# Altium project motion_board.PrjPcb
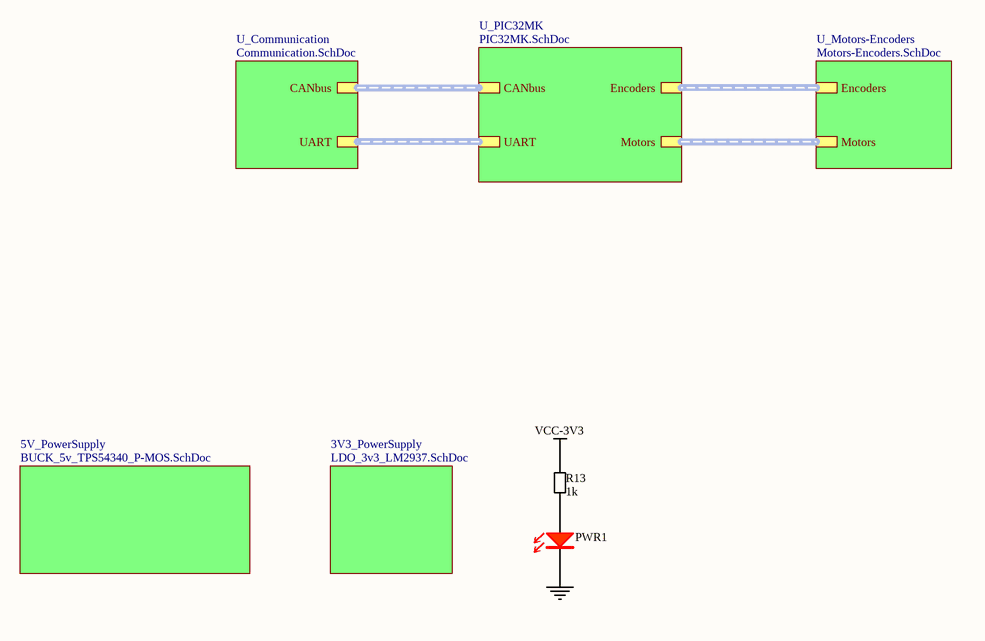
[diagram p0: Motion_Driver_v2.SchDoc]
11 sheets, 132 parts. Net scope: hierarchical (ports join the sheet entries above them; power ports are global).
Board file: Motion_Driver_v2.PcbDoc
Sheets:
  Motion_Driver_v2.SchDoc
    5V_PowerSupply = BUCK_5v_TPS54340_P-MOS.SchDoc
    3V3_PowerSupply = LDO_3v3_LM2937.SchDoc
    U_Communication = Communication.SchDoc
      CANbus = CANbus.SchDoc
    U_PIC32MK = PIC32MK.SchDoc
      Reset = MCLR_PIC.SchDoc
      Oscillator = 8MHz_Crystal.SchDoc
    U_Motors-Encoders = Motors-Encoders.SchDoc
      Encoder_Odometry_1 = Encoder.SchDoc
      Encoder_Odometry_2 = Encoder.SchDoc
      Encoder_Motor_1 = Encoder.SchDoc
      Encoder_Motor_2 = Encoder.SchDoc
      H-Bridge1 = H_Bridge.SchDoc
      H_Bridge_2 = H_Bridge.SchDoc

## Sheet Motion_Driver_v2.SchDoc: Motion Driver
size A4; Author: Nikola Rašević; Organization: Memristor-Robotics; Address1: Vladimira Perića Valtera 2; Address2: 21000 Novi Sad; Address3: Serbia; Revision: v2; SheetNumber: 1; SheetTotal: 11

### Parts
PWR1  LED RED  [LED_RED_0805]  (value not drawn)
R13  1k  [RESC2013X38N-0805-NOOVERLAY]

### Sub-sheets
3V3_PowerSupply = LDO_3v3_LM2937.SchDoc: no entries
5V_PowerSupply = BUCK_5v_TPS54340_P-MOS.SchDoc: no entries
U_Communication = Communication.SchDoc: CANbus (harness CANbus), UART (harness UART)
U_Motors-Encoders = Motors-Encoders.SchDoc: Encoders (harness Encoders), Motors (harness Motors)
U_PIC32MK = PIC32MK.SchDoc: CANbus (harness CANbus), UART (harness UART), Encoders (harness Encoders), Motors (harness Motors)

### Nets
GND: PWR1.1(C)
VCC-3V3: R13.2
NetPWR1_2: PWR1.2(A) R13.1

### Buses and harness runs
harness sheet U_Communication/CANbus = sheet U_PIC32MK/CANbus
harness sheet U_Communication/UART = sheet U_PIC32MK/UART
harness sheet U_Motors-Encoders/Encoders = sheet U_PIC32MK/Encoders
harness sheet U_Motors-Encoders/Motors = sheet U_PIC32MK/Motors

### Notes on the sheet
- Title
- Date:
- Design Engineer:
- Time:
- Revision:
- Sheet
- of
- Size:
- A4
- www.memristor-robotics.io
- File:

### Library data of the parts
PWR1 = LED_RED_0805: LED RED 0805; Manufacturer: BRIGHT LED ELECTRONICS; Manufacturer Part Number: BL-HUB35A-AV-TRB; Barcode: 2911010024321; id: 35; Assembly: SMD; Voltage Forward: 2.0 V; item_id: 3341; Recommended Rating: Platinum; Package Case: 0805 (2012 Metric); Color: Red; Family: LED; Part Type: Optoelectronics
R13 = 00001001: RES SMD 1 kOhm 1/8W 0805; Power: 0.125W, 1/8W; Barcode: 00009101; Resistance: 1k; Assembly: SMD

## Sheet BUCK_5v_TPS54340_P-MOS.SchDoc: Memristor Power 5.0
size A4; Author: Nikola Rašević; Organization: Memristor-Robotics; Address1: Vladimira Perića Valtera 2; Address2: 21000 Novi Sad; Address3: Serbia; Revision: v1; SheetNumber: 2; SheetTotal: 11
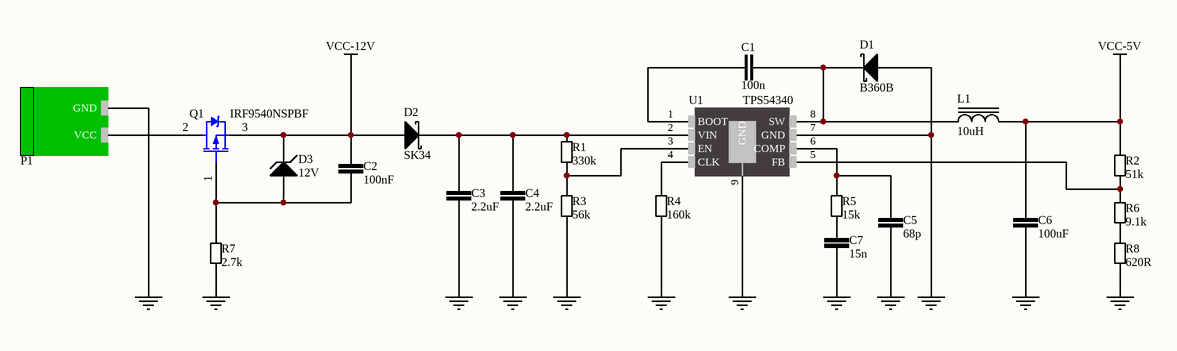
[diagram p1: BUCK_5v_TPS54340_P-MOS.SchDoc]

### Parts
C1  100n  [CER_0603]
C2  100nF  [CER_0805]
C3  2.2uF  [CER_1210]
C4  2.2uF  [CER_1210]
C5  68p  [CER_0603]
C6  100uF  [CER_1210]
C7  15n  [CER_0603]
D1  B360B  [DO214AC]
D2  SK34  [DO214AC]
D3  12V  [DO214AC]
L1  10uH  [INDUCTOR_SS1260-103MLD]
P1  2EDGRC-5.08-02P-14-00A(H)  [PWR_Con]  (value not drawn)
Q1  IRF9540NSPBF  [D2PAK-2]
R1  330k  [RESC2013X38N-0805-NOOVERLAY]
R2  51k  [RESC2013X38N-0805-NOOVERLAY]
R3  56k  [RESC2013X38N-0805-NOOVERLAY]
R4  160k  [RESC2013X38N-0805-NOOVERLAY]
R5  15k  [RESC2013X38N-0805-NOOVERLAY]
R6  9.1k  [RESC2013X38N-0805-NOOVERLAY]
R7  2.7k  [RESC2013X38N-0805-NOOVERLAY]
R8  620R  [RESC2013X38N-0805-NOOVERLAY]
U1  TPS54340  [HSOP-8]

### Nets
GND: C3.1 C4.1 C5.1 C6.1 C7.1 D1.2(Anode) P1.1(GND) R3.1 R4.1 R7.1 R8.1 U1.7(GND) U1.9(GND)
VCC-5V: C6.2 L1.2 R2.2
VCC-12V: C2.2 D2.2(Anode) D3.1(Cathode) Q1.3(S)
NetC1_1: C1.1 U1.1(BOOT)
NetC1_2: C1.2 D1.1(Cathode) L1.1 U1.8(SW)
NetC2_1: C2.1 D3.2(Anode) Q1.1(G) R7.2
NetC3_2: C3.2 C4.2 D2.1(Cathode) R1.2 U1.2(VIN)
NetC5_2: C5.2 R5.2 U1.6(COMP)
NetC7_2: C7.2 R5.1
NetP1_2: P1.2(VCC) Q1.2(D)
NetR1_1: R1.1 R3.2 U1.3(EN)
NetR2_1: R2.1 R6.2 U1.5(FB)
NetR4_2: R4.2 U1.4(CLK)
NetR6_1: R6.1 R8.2

### Notes on the sheet
- Title
- Date:
- Design Engineer:
- Time:
- Revision:
- Sheet
- of
- Size:
- A4
- www.memristor-robotics.io
- File:

### Library data of the parts
C1 = 06032105: CAP CER 100n 10V X5R 10% 0603; Capacitance: 100n
C2 = 00002105: CAP CER 100n 50V X7R 10% 0805; Capacitance: 100nF
C3 C4 = 00001225: CAP CER 2.2u; Value: 2.2uF
C5 = 06032680: CAP CER 68p 0603; Capacitance: 68p
C6 = 00002108: CAP CER 100u X5R 6.3V 10% 1210; Capacitance: 100uF
C7 = 06032153: CAP CER 15n 0603; Capacitance: 15n
D1 = B360B: DIODE SCHOTTKY 60V 3A DO214AC; Manufacturer: Vishay Semiconductor Diodes Division; Barcode: 0100000007488; id: 62; Assembly: SMD; Speed: Fast Recovery =< 500ns, > 200mA (Io); Voltage  Forward: 550mV @ 3A; item_id: 1025; Recommended Rating: Silver; Manufacturer Part Number: B360B; Category: Discrete Semiconductor Products; Datasheet URL: http://www.vishay.com/docs/88896/b330la.pdf; Package Case: DO-214AC, SMA; Family: DIODE; Voltage  DC Reverse: 60V; Current  Average Rectified: 3A; Diode Type: Schottky; Part Type: Discrete Semiconductors
D2 = SK34: DIODE SCHOTTKY 40V 3A DO214AC; Manufacturer: Vishay Semiconductor Diodes Division; Barcode: 0100000007488; id: 62; Assembly: SMD; Speed: Fast Recovery =< 500ns, > 200mA (Io); Voltage  Forward: 550mV @ 3A; item_id: 1025; Recommended Rating: Silver; Manufacturer Part Number: SK34; Category: Discrete Semiconductor Products; Datasheet URL: http://www.vishay.com/docs/88896/b330la.pdf; Package Case: DO-214AC, SMA; Family: DIODE; Voltage  DC Reverse: 40V; Current  Average Rectified: 3A; Diode Type: Schottky; Part Type: Discrete Semiconductors
D3 = ZENER: DIODE ZENER; Manufacturer: Vishay Semiconductor Diodes Division; Manufacturer Part Number: B360B; Barcode: 0100000007488; id: 62; Assembly: SMD; Speed: Fast Recovery =< 500ns, > 200mA (Io); Voltage  DC Reverse: 60V; Current  Average Rectified: 3A; Voltage  Forward: 550mV @ 3A; Diode Type: Schottky; item_id: 1025; Recommended Rating: Silver; Category: Discrete Semiconductor Products; Datasheet URL: http://www.vishay.com/docs/88896/b330la.pdf; Package Case: DO-214AC, SMA; Family: DIODE; Part Type: Discrete Semiconductors; Refferent Voltage: 12V
L1 = Inductor_10uH: FIXED IND 10uH 5.3A; Manufacturer: Coilcraft; Manufacturer Part Number: XAL7030-103MEB; Barcode: 2911010049126; id: 7; Assembly: SMD; Tolerance: 20%; Value: 10u; DC Resistance: 62.7mOhm; item_id: 5593; Category: Inductors, Coils, Chokes; Datasheet URL: http://www.mouser.com/ds/2/597/xal7030-270749.pdf; Package Case: 8x8mm; Inductance: 10uH; Current Rating: 5.3A; Family: INDUCTOR; Part Type: Inductor, Transf, Filter, Ferrite
P1 = 00000002: TERM BLOCK HDR 2POS 90DEG 5.08MM; Suplier: TME; Manufacturer Part Number: 2EDGRC-5.08-02P-14-00A(H); Suplier Product Link: https://www.tme.eu/en/details/2edgrc5.08-2p14/pluggable-terminal-blocks/degson-electronics/2edgrc-508-02p-14-00ah/; Price: 0.1304
Q1 = IRF9540N: P-MOS; Manufacturer: INTERNATIONAL RECTIFIER; Manufacturer Part Number: IRF9540NSPBF; Order Code: IRF9540NS; Package: TO-263 SMD; Price: DIN 62.54; Supplier: Comet.rs
R1 = 00003303: RES SMD 330 kOhm 1/8W 0805; Power: 0.125W, 1/8W; Resistance: 330k; Assembly: SMD; Barcode: 00003303
R2 = 00005102: RES SMD 51 kOhm 1/8W 0805; Power: 0.125W, 1/8W; Resistance: 51k; Assembly: SMD; Barcode: 00005102
R3 = 00005602: RES SMD 56 kOhm 1/8W 0805; Power: 0.125W, 1/8W; Barcode: 00004701; Resistance: 56k; Assembly: SMD
R4 = 00001603: RES SMD 160 kOhm 1/8W 0805; Power: 0.125W, 1/8W; Resistance: 160k; Assembly: SMD; Barcode: 00001603
R5 = 00001502: RES SMD 15 kOhm 1/8W 0805; Power: 0.125W, 1/8W; Resistance: 15k; Assembly: SMD; Barcode: 00001502
R6 = 00009101: RES SMD 9.1 kOhm 1/8W 0805; Power: 0.125W, 1/8W; Resistance: 9.1k; Assembly: SMD; Barcode: 00009101
R7 = 00002701: RES SMD 2.7 kOhm 1/8W 0805; Power: 0.125W, 1/8W; Barcode: 00004701; Resistance: 2.7k; Assembly: SMD
R8 = 00006200: RES SMD 620 Ohm 1/8W 0805; Power: 0.125W, 1/8W; Resistance: 620R; Assembly: SMD; Barcode: 00006200
U1 = TPS54340: IC REG BUCK ADJ 3.5A 8SOPWRPAD; Assembly: SMD; Manufacturer Part Number: TPS54340

## Sheet LDO_3v3_LM2937.SchDoc: 3v3 LDO Module
size A4; Author: Nikola Rašević; Organization: Memristor Robotics; SheetNumber: 3; SheetTotal: 11
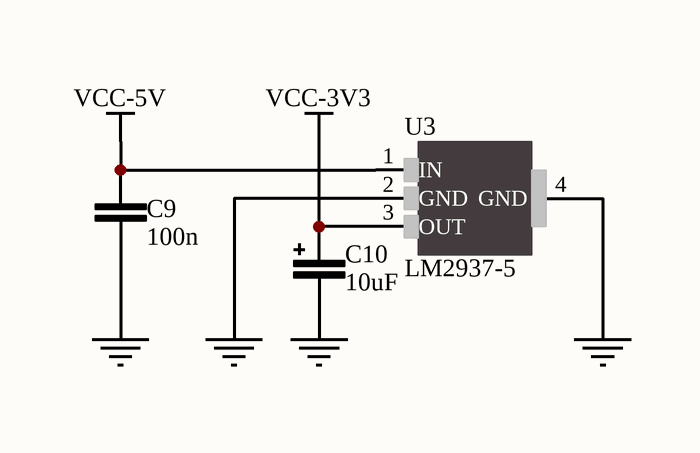
[diagram p2: LDO_3v3_LM2937.SchDoc]

### Parts
C9  100n  [CER_0603]
C10  10uF  [TANT_1210]
U3  LM2937-5  [SOT223]

### Nets
GND: C9.1 C10.2 U3.2(GND) U3.4(GND)
VCC-3V3: C10.1 U3.3(OUT)
VCC-5V: C9.2 U3.1(IN)

### Notes on the sheet
- Title
- Date:
- Design Engineer:
- Time:
- Revision:
- Sheet
- of
- Size:
- A4
- www.memristor-robotics.io
- File:

### Library data of the parts
C9 = 06032105: CAP CER 100n 10V X5R 10% 0603; Capacitance: 100n
C10 = 00001106: CAP TANT 10u; Value: 10uF
U3 = 00000007: IC REG LINEAR 5V 400MA SOT223-4; Manufacturer Part Number: LM2937-5; Datasheet Link: http://www.ti.com/lit/ds/symlink/lm2937.pdf

## Sheet Communication.SchDoc
size A4; Organization: Memristor-Robotics; Address1: Vladimira Perića Valtera; Address2: Novi Sad, 21000; Address3: Serbia; SheetNumber: 7; SheetTotal: 11
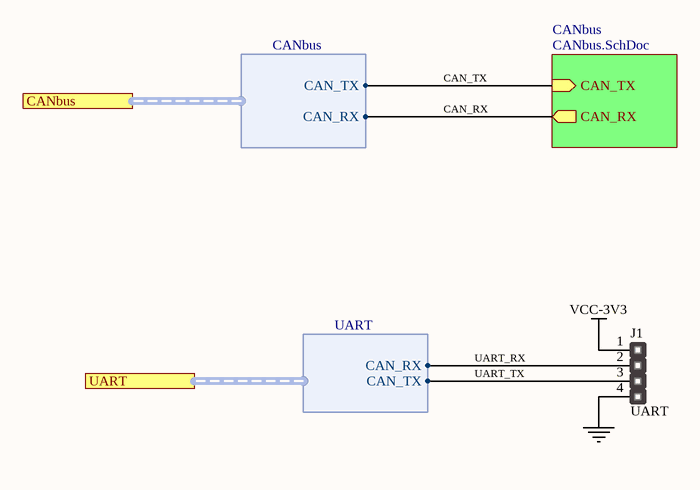
[diagram p3: Communication.SchDoc]

### Parts
J1  UART  [HM1X4]

### Sub-sheets
CANbus = CANbus.SchDoc: CAN_TX (in), CAN_RX (out)

### Ports
CANbus (harness CANbus), UART (harness UART)

### Harnesses
CANbus: CAN_TX, CAN_RX
UART: CAN_TX, CAN_RX

### Nets
GND: J1.4
VCC-3V3: J1.1
CAN_RX: sheet CANbus/CAN_RX, port CANbus.CAN_RX
CAN_TX: sheet CANbus/CAN_TX, port CANbus.CAN_TX
UART_RX: J1.2 ; port UART.CAN_RX
UART_TX: J1.3 ; port UART.CAN_TX

### Notes on the sheet
- Title
- Date:
- Design Engineer:
- Time:
- Revision:
- Sheet
- of
- Size:
- A4
- www.memristor-robotics.io
- File:

### Library data of the parts
J1 = HEADER_1x4

## Sheet CANbus.SchDoc: CANbus Module
size A4; Author: Nikola Rašević; Organization: Memristor Robotics; SheetNumber: 8; SheetTotal: 11
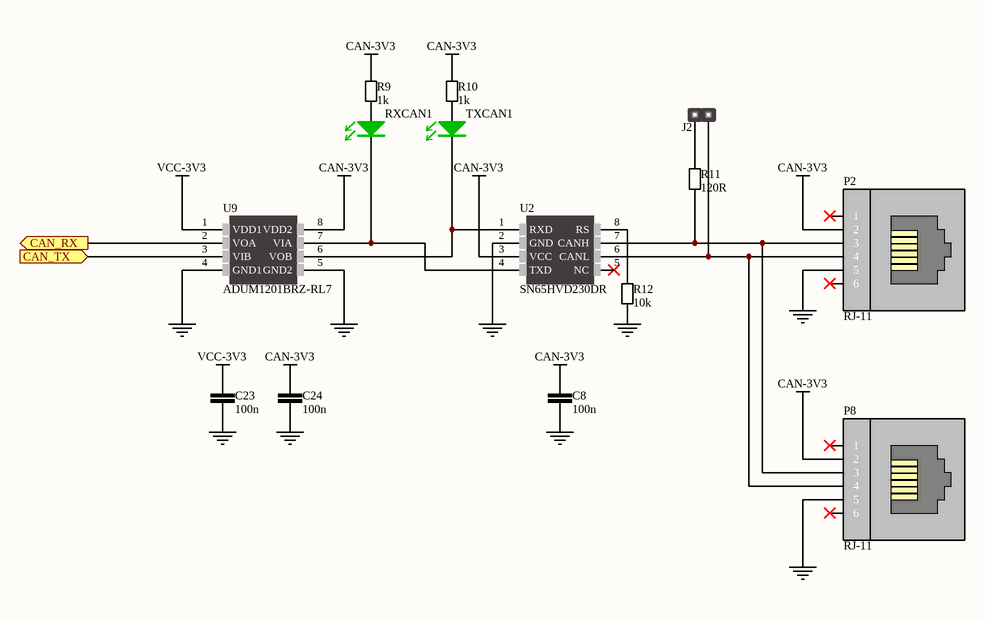
[diagram p4: CANbus.SchDoc]

### Parts
C8  100n  [CER_0805]
C23  100n  [CER_0805]
C24  100n  [CER_0805]
J2  *  [HM1x2]  (value not drawn)
P2  RJ-11  [RJ11-6N-B]
P8  RJ-11  [RJ11-6N-B]
R9  1k  [RESC2013X38N-0805-NOOVERLAY]
R10  1k  [RESC2013X38N-0805-NOOVERLAY]
R11  120R  [RESC2013X38N-0805-NOOVERLAY]
R12  10k  [RESC2013X38N-0805-NOOVERLAY]
RXCAN1  LED GREEN  [LED_GREEN_0805]  (value not drawn)
TXCAN1  LED GREEN  [LED_GREEN_0805]  (value not drawn)
U2  SN65HVD230DR  [SOIC-8]
U9  ADUM1201BRZ-RL7  [SOIC-8]

### Ports
CAN_RX (out), CAN_TX (in)

### Nets
CAN-3V3: C8.2 C24.2 P2.2 P8.2 R9.2 R10.2 U2.3(VCC) U9.8(VDD2)
GND: C8.1 C23.1 C24.1 P2.5 P8.5 R12.1 U2.2(GND) U9.4(GND1) U9.5(GND2)
VCC-3V3: C23.2 U9.1(VDD1)
CAN_RX: U9.2(VOA) ; port CAN_RX
CAN_TX: U9.3(VIB) ; port CAN_TX
NetJ2_1: J2.1 R11.2
NetJ2_2: J2.2 P2.4 P8.4 U2.6(CANL)
NetP2_3: P2.3 P8.3 R11.1 U2.7(CANH)
NetR9_1: R9.1 RXCAN1.2(A)
NetR10_1: R10.1 TXCAN1.2(A)
NetR12_2: R12.2 U2.8(RS)
NetRXCAN1_1: RXCAN1.1(C) U2.4(TXD) U9.7(VIA)
NetTXCAN1_1: TXCAN1.1(C) U2.1(RXD) U9.6(VOB)

Not connected (* = marked no-connect by the designer): P2 1* 6*; P8 1* 6*; U2 5(NC)*

### Notes on the sheet
- Title
- Date:
- Design Engineer:
- Time:
- Revision:
- Sheet
- of
- Size:
- A4
- www.memristor-robotics.io
- File:

### Library data of the parts
C8 C23 C24 = 06032105: CAP CER 100n 10V X5R 10% 0603; Capacitance: 100n
J2 = HEADER_1x2: Manufacturer Part Number: *
P2 = 00000001: Manufacturer Part Number: RJ-11
P8 = 00000001: CONN MOD JACK 6P4C R/A UNSHLD; Manufacturer Part Number: 0955012641; Type: RJ-11
R9 R10 = 00001001: as R13 on sheet Motion_Driver_v2; Resistance: 1k; Assembly: SMD
R11 = 000001200: RES SMD 120 Ohm 1/8W 0805; Resistance: 120R
R12 = 000001002: RES SMD 10 kOhm 1/8W 0805; Resistance: 10k
RXCAN1 TXCAN1 = LED_GREEN 0805: LED GREEN CLEAR 0805 SMD; Manufacturer: Kingbright; Manufacturer Part Number: APT2012SGC; Barcode: 2911010024338; id: 28; Voltage Forward: 2.2V; Wavelength: 568nm; Lens Color: Colorless; item_id: 3342; Recommended Rating: Platinum; Category: Optoelectronics; Assembly: SMD; Datasheet URL: http://www.kingbrightusa.com/images/catalog/SPEC/APT2012SGC.pdf; Package Case: 0805 (2012 Metric); Color: Green; Family: LED; Lens Transparency: Clear; Part Type: Optoelectronics
U2 = SN65HVD230: IC EMC CAN TRANSCEIVER 8-SOIC; Assembly: SMD; Barcode: 00000001; Manufacturer Part Number: SN65HVD230DR; Comet Product Page: http://store.comet.rs/Catalogue/Product/9057/; Datasheet Link: http://www.ti.com/lit/ds/symlink/sn65hvd232.pdf; Category: Integrated Circuits (ICs); Package: SOIC-8; Family: Comunication
U9 = ADUM1201BRZ: DGTL ISO 2.5KV GEN PURP 8SOIC; Assembly: SMD; Barcode: 00000001; Manufacturer Part Number: ADUM1201BRZ-RL7; Datasheet Link: http://www.analog.com/media/en/technical-documentation/data-sheets/ADuM1200_1201.pdf; Category: Integrated Circuits (ICs); Package: SOIC-8; Family: Comunication

## Sheet PIC32MK.SchDoc
size A4; Organization: Memristor-Robotics; Address1: Vladimira Perića Valtera; Address2: Novi Sad, 21000; Address3: Serbia; SheetNumber: 4; SheetTotal: 11
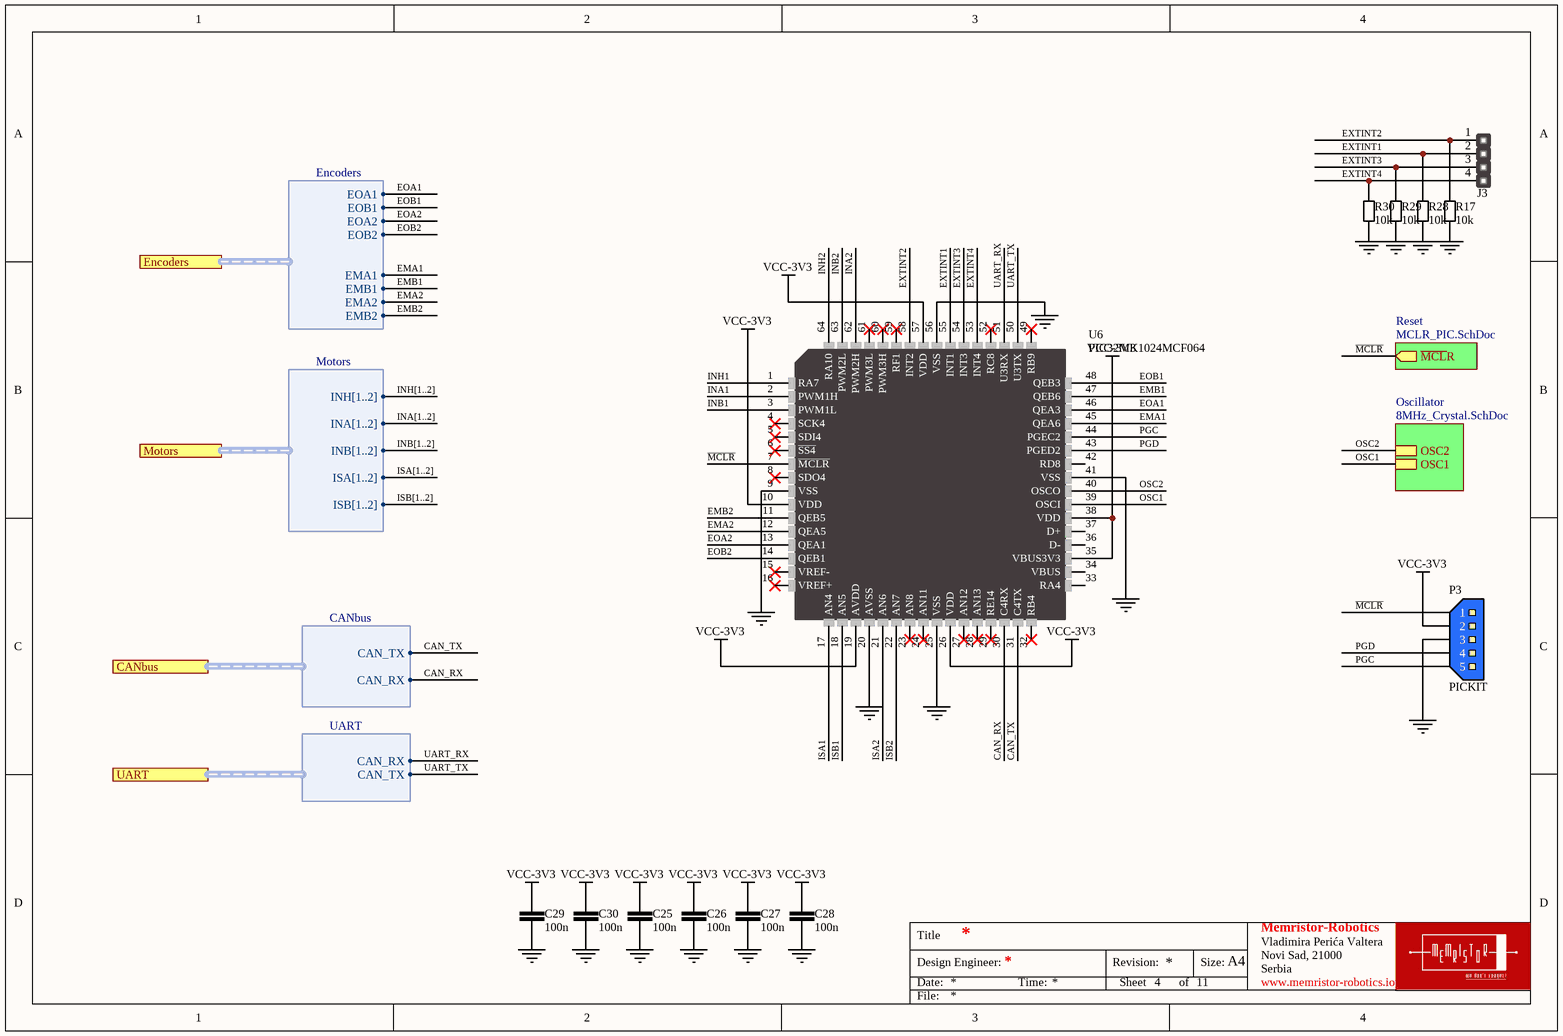
[diagram p5: PIC32MK.SchDoc]

### Parts
C25  100n  [CER_0603]
C26  100n  [CER_0603]
C27  100n  [CER_0603]
C28  100n  [CER_0603]
C29  100n  [CER_0603]
C30  100n  [CER_0603]
J3  EXTINT  [HM1X4]  (value not drawn)
P3  PICKIT  [TE CONNECTIVITY_5PIN_MALE]
R17  10k  [RESC2013X38N-0805-NOOVERLAY]
R28  10k  [RESC2013X38N-0805-NOOVERLAY]
R29  10k  [RESC2013X38N-0805-NOOVERLAY]
R30  10k  [RESC2013X38N-0805-NOOVERLAY]
U6  PIC32MK1024MCF064  [TQFP-64-500um]

### Sub-sheets
Oscillator = 8MHz_Crystal.SchDoc: OSC2, OSC1
Reset = MCLR_PIC.SchDoc: ~{MCL}R (out)

### Ports
CANbus (harness CANbus), Encoders (harness Encoders), Motors (harness Motors), UART (harness UART)

### Harnesses
CANbus: CAN_TX, CAN_RX
UART: CAN_TX, CAN_RX
Encoders: EOA1, EOA2, EMA1, EMA2, EOB1, EOB2, EMB1, EMB2
Motors: INH[1..2], INB[1..2], ISB[1..2], INA[1..2], ISA[1..2]

### Nets
GND: C25.1 C26.1 C27.1 C28.1 C29.1 C30.1 P3.3 R17.1 R28.1 R29.1 R30.1 U6.9(VSS) U6.20(AVSS) U6.25(VSS) U6.41(VSS) U6.56(VSS)
VCC-3V3: C25.2 C26.2 C27.2 C28.2 C29.2 C30.2 P3.2 U6.10(VDD) U6.19(AVDD) U6.26(VDD) U6.35(VBUS3V3) U6.38(VDD) U6.57(VDD)
CAN_RX: U6.30(C4RX) ; port CANbus.CAN_RX
CAN_TX: U6.31(C4TX) ; port CANbus.CAN_TX
EMA1: U6.45(QEA6) ; port Encoders.EMA1
EMA2: U6.12(QEA5) ; port Encoders.EMA2
EMB1: U6.47(QEB6) ; port Encoders.EMB1
EMB2: U6.11(QEB5) ; port Encoders.EMB2
EOA1: U6.46(QEA3) ; port Encoders.EOA1
EOA2: U6.13(QEA1) ; port Encoders.EOA2
EOB1: U6.48(QEB3) ; port Encoders.EOB1
EOB2: U6.14(QEB1) ; port Encoders.EOB2
EXTINT1: J3.2 R28.2 U6.55(INT1)
EXTINT2: J3.1 R17.2 U6.58(INT2)
EXTINT3: J3.3 R29.2 U6.54(INT3)
EXTINT4: J3.4 R30.2 U6.53(INT4)
INA1: U6.2(PWM1H)
INA2: U6.62(PWM2H)
INB1: U6.3(PWM1L)
INB2: U6.63(PWM2L)
INH1: U6.1(RA7)
INH2: U6.64(RA10)
ISA1: U6.17(AN4)
ISA2: U6.21(AN6)
ISB1: U6.18(AN5)
ISB2: U6.22(AN7)
~{MCLR}: P3.1 U6.7(~{MCLR}) ; sheet Reset/~{MCL}R
OSC1: U6.39(OSCI) ; sheet Oscillator/OSC1
OSC2: U6.40(OSCO) ; sheet Oscillator/OSC2
PGC: P3.5 U6.44(PGEC2)
PGD: P3.4 U6.43(PGED2)
UART_RX: U6.51(U3RX) ; port UART.CAN_RX
UART_TX: U6.50(U3TX) ; port UART.CAN_TX

Not connected (* = marked no-connect by the designer): U6 4(SCK4)* 5(SDI4)* 6(~{SS4})* 8(SDO4)* 15(VREF-)* 16(VREF+)* 23(AN8)* 24(AN11)* 27(AN12)* 28(AN13)* 29(RE14)* 32(RB4)* 33(RA4) 34(VBUS) 36(D-) 37(D+) 42(RD8) 49(RB9)* 52(RC8)* 59(RF1)* 60(PWM3H)* 61(PWM3L)*

### Buses and harness runs
bus INA[1..2]
bus INB[1..2]
bus INH[1..2]
bus ISA[1..2]
bus ISB[1..2]

### Notes on the sheet
- Title
- Date:
- Design Engineer:
- Time:
- Revision:
- Sheet
- of
- Size:
- A4
- www.memristor-robotics.io
- File:
- (in symbol PIC32MK) RF1; RC8; RA10; INT2; VDD; VSS; INT1; INT3; INT4; RB9; U3RX; U3TX; PWM2L; PWM2H; PWM3L; PWM3H; RA7; QEB3; PWM1H; QEB6; PWM1L; QEA3; SCK4; QEA6; SDI4; PGEC2; SS4; PGED2; MCLR; RD8/VBAT; SDO4; OSC0; OSC1; QEB5; QEA5; D+; QEA1; D-; QEB1; VBUS3V3; VREF-; VBUS; VREF+; RA4; AN4; AN5; AVDD; AVSS; AN6; AN7; AN8; AN11; AN12; AN13; RE14; C4RX; C4TX; RB4

### Library data of the parts
C25-C30 = 06032105: CAP CER 100n 10V X5R 10% 0603; Capacitance: 100n
J3 = HEADER_1x4
P3 = TE CONNECTIVITY_5PIN_MALE: BLUE_5PIN_CONECTOR; Manufacturer: TE CONNECTIVITY / AMP; Manufacturer Part Number 1: 281695-3; Order Code 1: 1205983; Price 1: £0.403; Supplier 1: uk.farnell.com
R17 R28-R30 = 000001002: RES SMD 10 kOhm 1/8W 0805; Resistance: 10k
U6 = PIC32MK1024MCF064: IC MCU 32BIT 1MB FLASH 64TQFP; Manufacturer Part Number: PIC32MK1024MCF064

## Sheet MCLR_PIC.SchDoc
size A4; SheetNumber: 6; SheetTotal: 11
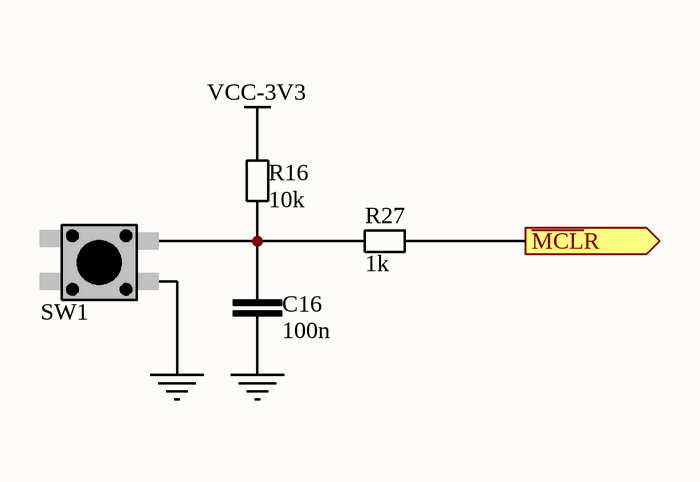
[diagram p6: MCLR_PIC.SchDoc]

### Parts
C16  100n  [CER_0603]
R16  10k  [RESC2013X38N-0805-NOOVERLAY]
R27  1k  [RESC2013X38N-0805-NOOVERLAY]
SW1  TASTER  [TASTER_SMD]  (value not drawn)

### Ports
~{MCL}R (out)

### Nets
GND: C16.1 SW1.1
VCC-3V3: R16.2
~{MCLR}: R27.2 ; port ~{MCL}R
NetC16_2: C16.2 R16.1 R27.1 SW1.2

### Notes on the sheet
- Title
- Date:
- Design Engineer:
- Time:
- Revision:
- Sheet
- of
- Size:
- A4
- www.memristor-robotics.io
- File:

### Library data of the parts
C16 = 06032105: CAP CER 100n 10V X5R 10% 0603; Capacitance: 100n
R16 = 000001002: RES SMD 10 kOhm 1/8W 0805; Resistance: 10k
R27 = 00001001: as R13 on sheet Motion_Driver_v2; Resistance: 1k; Assembly: SMD

## Sheet 8MHz_Crystal.SchDoc: 8MHz Crystal Oscillator Module
size A4; Author: Nikola Rašević; Organization: Memristor Robotics; SheetNumber: 5; SheetTotal: 11
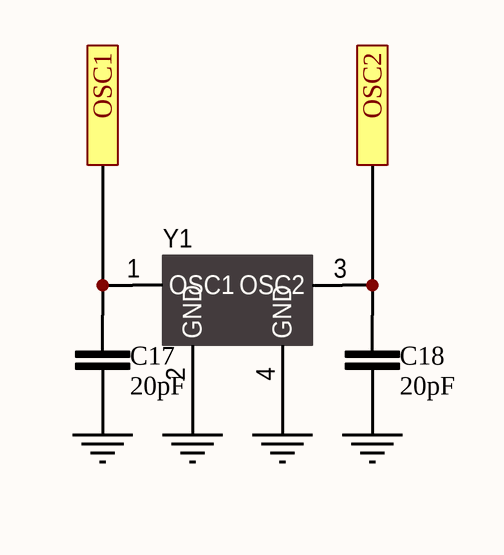
[diagram p7: 8MHz_Crystal.SchDoc]

### Parts
C17  20pF  [CER_0603]
C18  20pF  [CER_0603]
Y1  8Hz  [ABM10]  (value not drawn)

### Ports
OSC1, OSC2

### Nets
GND: C17.1 C18.1 Y1.2(GND) Y1.4(GND)
OSC1: C17.2 Y1.1(OSC1) ; port OSC1
OSC2: C18.2 Y1.3(OSC2) ; port OSC2

### Notes on the sheet
- Title
- Date:
- Design Engineer:
- Time:
- Revision:
- Sheet
- of
- Size:
- A4
- www.memristor-robotics.io
- File:

### Library data of the parts
C17 C18 = 00002200: CAP CER 20p 0805; Capacitance: 20pF
Y1 = QUARTZ_8MHz: CRYSTAL 8.0000MHZ 18PF SMD; Manufacturer: ABRACON; Manufacturer Part Number: ABMM2-8.000MHZ-E2-T; id: 17; Frequency Stability: ±30ppm; Equivalent Series Resistance: 72 Ohm; item_id: 4360; Category: Crystals and Oscillators; Assembly: SMD; Datasheet URL: http://www.abracon.com/Resonators/ABMM2.pdf; Package Case: 4-SMD, No Lead (DFN, LCC); Frequency: 8Hz; Frequency Tolerance: ±30ppm; Load Capacitance: 18pF; Family: CRYSTAL; Size Dimension: 0.126" L x 0.098" W (3.20mm x 2.50mm); Part Type: Crystals, Oscillators

## Sheet Motors-Encoders.SchDoc
size A4; Organization: Memristor-Robotics; Address1: Vladimira Perića Valtera; Address2: Novi Sad, 21000; Address3: Serbia; SheetNumber: 9; SheetTotal: 11
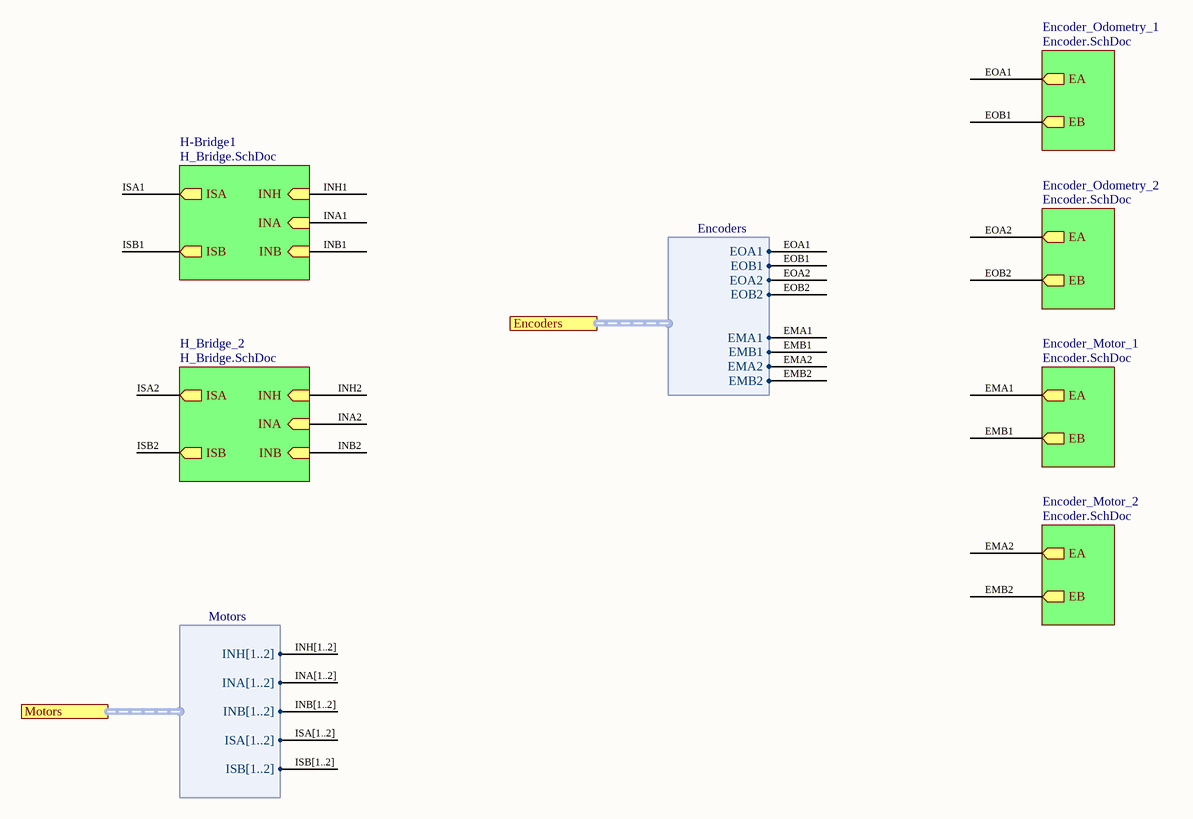
[diagram p8: Motors-Encoders.SchDoc]

### Sub-sheets
Encoder_Motor_1 = Encoder.SchDoc: EA (out), EB (out)
Encoder_Motor_2 = Encoder.SchDoc: EA (out), EB (out)
Encoder_Odometry_1 = Encoder.SchDoc: EA (out), EB (out)
Encoder_Odometry_2 = Encoder.SchDoc: EA (out), EB (out)
H-Bridge1 = H_Bridge.SchDoc: INH (in), INA (in), INB (in), ISA (out), ISB (out)
H_Bridge_2 = H_Bridge.SchDoc: INH (in), INA (in), INB (in), ISA (out), ISB (out)

### Ports
Encoders (harness Encoders), Motors (harness Motors)

### Harnesses
Encoders: EOA1, EOA2, EMA1, EMA2, EOB1, EOB2, EMB1, EMB2
Motors: INH[1..2], INB[1..2], ISB[1..2], INA[1..2], ISA[1..2]

### Nets
EMA1: sheet Encoder_Motor_1/EA, port Encoders.EMA1
EMA2: sheet Encoder_Motor_2/EA, port Encoders.EMA2
EMB1: sheet Encoder_Motor_1/EB, port Encoders.EMB1
EMB2: sheet Encoder_Motor_2/EB, port Encoders.EMB2
EOA1: sheet Encoder_Odometry_1/EA, port Encoders.EOA1
EOA2: sheet Encoder_Odometry_2/EA, port Encoders.EOA2
EOB1: sheet Encoder_Odometry_1/EB, port Encoders.EOB1
EOB2: sheet Encoder_Odometry_2/EB, port Encoders.EOB2

### Buses and harness runs
bus INA[1..2]
bus INB[1..2]
bus INH[1..2]
bus ISA[1..2]
bus ISB[1..2]

### Notes on the sheet
- Title
- Date:
- Design Engineer:
- Time:
- Revision:
- Sheet
- of
- Size:
- A4
- www.memristor-robotics.io
- File:

## Sheet Encoder.SchDoc: Encoder
size A4; Author: Nikola Rašević; Organization: Memristor-Robotics; Address1: Vladimira Periá Valtera 2; Address2: 21000 Novi Sad; Address3: Serbia; SheetNumber: 11; SheetTotal: 11
Used 4 times, as channels U_Motors-Encoders/Encoder_Odometry_1, U_Motors-Encoders/Encoder_Odometry_2, U_Motors-Encoders/Encoder_Motor_1, U_Motors-Encoders/Encoder_Motor_2. Parts and nets are listed once, with the designators drawn on the sheet.
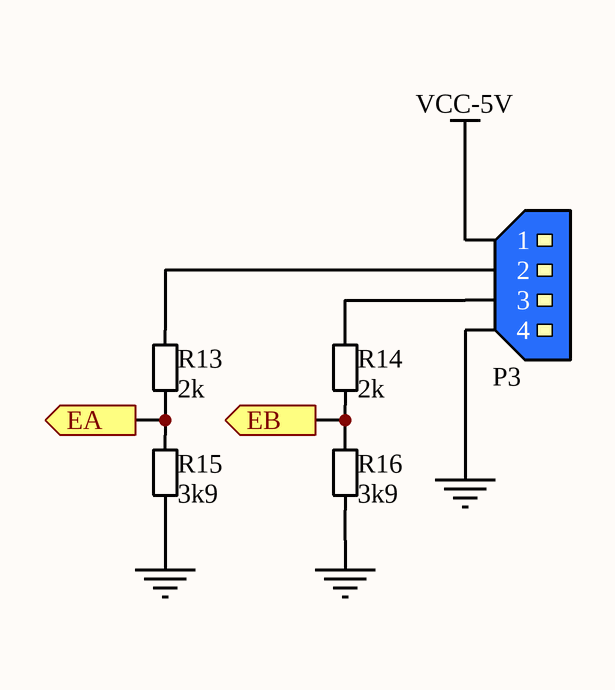
[diagram p9: Encoder.SchDoc]

### Parts
P3  TE CONNECTIVITY_4PIN_MALE  [TE CONNECTIVITY_4PIN_MALE]  (value not drawn)
R13  2k  [RESC2013X38N-0805-NOOVERLAY]
R14  2k  [RESC2013X38N-0805-NOOVERLAY]
R15  3k9  [RESC2013X38N-0805-NOOVERLAY]
R16  3k9  [RESC2013X38N-0805-NOOVERLAY]

### Ports
EA (out), EB (out)

### Nets
GND: P3.4 R15.1 R16.1
VCC-5V: P3.1
EA: R13.1 R15.2 ; port EA
EB: R14.1 R16.2 ; port EB
NetP3_2: P3.2 R13.2
NetP3_3: P3.3 R14.2

### Channels
U_Motors-Encoders/Encoder_Odometry_1: designators end in _Encoder_Odometry_1; ports EA=EOA1 EB=EOB1
U_Motors-Encoders/Encoder_Odometry_2: designators end in _Encoder_Odometry_2; ports EA=EOA2 EB=EOB2
U_Motors-Encoders/Encoder_Motor_1: designators end in _Encoder_Motor_1; ports EA=EMA1 EB=EMB1
U_Motors-Encoders/Encoder_Motor_2: designators end in _Encoder_Motor_2; ports EA=EMA2 EB=EMB2

### Notes on the sheet
- Title
- Date:
- Design Engineer:
- Time:
- Revision:
- Sheet
- of
- Size:
- A4
- www.memristor-robotics.io
- File:

### Library data of the parts
P3 = TE CONNECTIVITY_4PIN_MALE: BLUE_4PIN_CONECTOR; Manufacturer: TE CONNECTIVITY / AMP; Manufacturer Part Number 1: 281695-3; Order Code 1: 1205983; Price 1: £0.403; Supplier 1: uk.farnell.com
R13 R14 = 00002001: RES SMD 2 kOhm 1/8W 0805; Power: 0.125W, 1/8W; Barcode: 00009101; Resistance: 2k; Assembly: SMD
R15 R16 = 00003901: RES SMD 3.9 kOhm 1/8W 0805; Power: 0.125W, 1/8W; Barcode: 00009101; Resistance: 3k9; Assembly: SMD

## Sheet H_Bridge.SchDoc: Memristor HDrive
size A4; Author: Nikola Rašević; Organization: Memristor-Robotics; Address1: Vladimira Perića Valtera 2; Address2: 21000 Novi Sad; Address3: Serbia; SheetNumber: 10; SheetTotal: 11
Used 2 times, as channels U_Motors-Encoders/H-Bridge1, U_Motors-Encoders/H_Bridge_2. Parts and nets are listed once, with the designators drawn on the sheet.
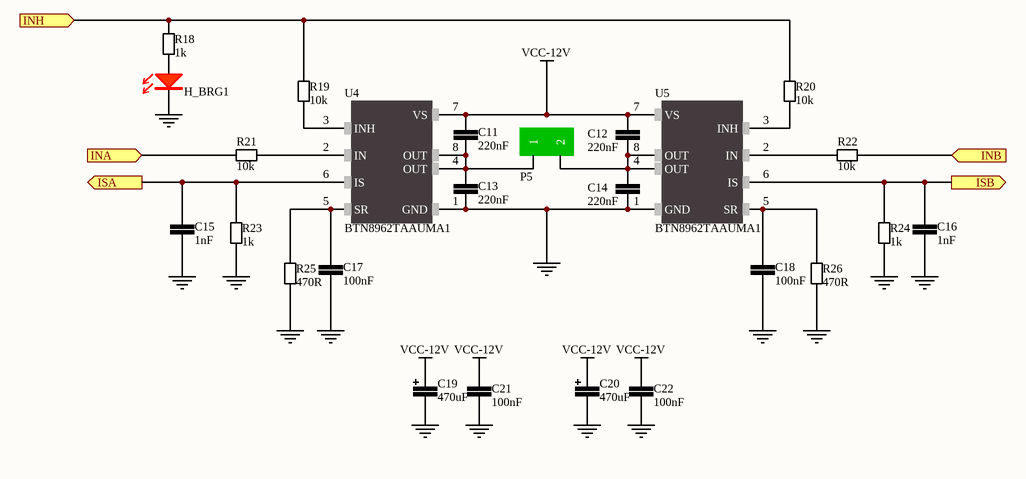
[diagram p10: H_Bridge.SchDoc]

### Parts
C11  220nF  [CER_0805]
C12  220nF  [CER_0805]
C13  220nF  [CER_0805]
C14  220nF  [CER_0805]
C15  1nF  [CER_0805]
C16  1nF  [CER_0805]
C17  100nF  [CER_0805]
C18  100nF  [CER_0805]
C19  470uF  [CAP10X20_RADIAL]
C20  470uF  [CAP10X20_RADIAL]
C21  100nF  [CER_0805]
C22  100nF  [CER_0805]
H_BRG1  LED RED  [LED_RED_0805]  (value not drawn)
P5  *  [MOTOR_CON]  (value not drawn)
R18  1k  [RESC2013X38N-0805-NOOVERLAY]
R19  10k  [RESC2013X38N-0805-NOOVERLAY]
R20  10k  [RESC2013X38N-0805-NOOVERLAY]
R21  10k  [RESC2013X38N-0805-NOOVERLAY]
R22  10k  [RESC2013X38N-0805-NOOVERLAY]
R23  1k  [RESC2013X38N-0805-NOOVERLAY]
R24  1k  [RESC2013X38N-0805-NOOVERLAY]
R25  470R  [RESC2013X38N-0805-NOOVERLAY]
R26  470R  [RESC2013X38N-0805-NOOVERLAY]
U4  BTN8962TAAUMA1  [TO263-7]
U5  BTN8962TAAUMA1  [TO263-7]

### Ports
INA (in), INB (in), INH (in), ISA (out), ISB (out)

### Nets
GND: C13.1 C14.1 C15.1 C16.1 C17.1 C18.1 C19.2 C20.2 C21.1 C22.1 H_BRG1.1(C) R23.1 R24.1 R25.1 R26.1 U4.1(GND) U5.1(GND)
VCC-12V: C11.2 C12.1 C19.1 C20.1 C21.2 C22.2 U4.7(VS) U5.7(VS)
INA: R21.2 ; port INA
INB: R22.2 ; port INB
INH: R18.2 R19.2 R20.2 ; port INH
ISA: C15.2 R23.2 U4.6(IS) ; port ISA
ISB: C16.2 R24.2 U5.6(IS) ; port ISB
NetC11_1: C11.1 C13.2 P5.1 U4.4(OUT) U4.8(OUT)
NetC12_2: C12.2 C14.2 P5.2 U5.4(OUT) U5.8(OUT)
NetC17_2: C17.2 R25.2 U4.5(SR)
NetC18_2: C18.2 R26.2 U5.5(SR)
NetH_BRG1_2: H_BRG1.2(A) R18.1
NetR19_1: R19.1 U4.3(INH)
NetR20_1: R20.1 U5.3(INH)
NetR21_1: R21.1 U4.2(IN)
NetR22_1: R22.1 U5.2(IN)

### Channels
U_Motors-Encoders/H-Bridge1: designators end in _H-Bridge1; ports INA=INA1 INB=INB1 INH=INH1 ISA=ISA1 ISB=ISB1
U_Motors-Encoders/H_Bridge_2: designators end in _H_Bridge_2; ports INA=INA2 INB=INB2 INH=INH2 ISA=ISA2 ISB=ISB2

### Notes on the sheet
- Title
- Date:
- Design Engineer:
- Time:
- Revision:
- Sheet
- of
- Size:
- A4
- www.memristor-robotics.io
- File:

### Library data of the parts
C11-C14 = 00002205: CAP CER 220n 10V X5R 10% 0805; Capacitance: 220nF
C15 C16 = 00002105_1: CAP CER 1n 50V X7R 10% 0805; Capacitance: 1nF
C17 C18 C21 C22 = 00002105: CAP CER 100n 50V X7R 10% 0805; Capacitance: 100nF
C19 C20 = 00004707: CAP ALU 470u 25V 20%; Capacitance: 470uF
H_BRG1 = LED_RED_0805: as PWR1 on sheet Motion_Driver_v2; Package Case: 0805 (2012 Metric); Color: Red; Family: LED; Part Type: Optoelectronics
P5 = MOT_CONN: CONNECTOR FOR MOTOR OUTPUT; Manufacturer Part Number: *
R18 R23 R24 = 00001001: as R13 on sheet Motion_Driver_v2; Resistance: 1k; Assembly: SMD
R19-R22 = 000001002: RES SMD 10 kOhm 1/8W 0805; Resistance: 10k
R25 R26 = 00004700: RES SMD 470 Ohm 1/8W 0805; Power: 0.125W, 1/8W; Barcode: 00006200; Resistance: 470R; Assembly: SMD
U4 U5 = 00000010: IC MOTOR DRIVER PAR TO263-7; Manufacturer Part Number: BTN8962TAAUMA1

## Nets that join several sheets
GND: Motion_Driver_v2 (PWR1.1), BUCK_5v_TPS54340_P-MOS (13 pins), LDO_3v3_LM2937 (C9.1 C10.2 U3.2 U3.4), Communication (J1.4), CANbus (9 pins), PIC32MK (16 pins), MCLR_PIC (C16.1 SW1.1), 8MHz_Crystal (C17.1 C18.1 Y1.2 Y1.4), U_Motors-Encoders/Encoder_Odometry_1 (P3_Encoder_Odometry_1.4 R15_Encoder_Odometry_1.1 R16_Encoder_Odometry_1.1), U_Motors-Encoders/Encoder_Odometry_2 (P3_Encoder_Odometry_2.4 R15_Encoder_Odometry_2.1 R16_Encoder_Odometry_2.1), U_Motors-Encoders/Encoder_Motor_1 (P3_Encoder_Motor_1.4 R15_Encoder_Motor_1.1 R16_Encoder_Motor_1.1), U_Motors-Encoders/Encoder_Motor_2 (P3_Encoder_Motor_2.4 R15_Encoder_Motor_2.1 R16_Encoder_Motor_2.1), U_Motors-Encoders/H-Bridge1 (17 pins), U_Motors-Encoders/H_Bridge_2 (17 pins)
VCC-3V3: Motion_Driver_v2 (R13.2), LDO_3v3_LM2937 (C10.1 U3.3), Communication (J1.1), CANbus (C23.2 U9.1), PIC32MK (13 pins), MCLR_PIC (R16.2)
VCC-5V: BUCK_5v_TPS54340_P-MOS (C6.2 L1.2 R2.2), LDO_3v3_LM2937 (C9.2 U3.1), U_Motors-Encoders/Encoder_Odometry_1 (P3_Encoder_Odometry_1.1), U_Motors-Encoders/Encoder_Odometry_2 (P3_Encoder_Odometry_2.1), U_Motors-Encoders/Encoder_Motor_1 (P3_Encoder_Motor_1.1), U_Motors-Encoders/Encoder_Motor_2 (P3_Encoder_Motor_2.1)
VCC-12V: BUCK_5v_TPS54340_P-MOS (C2.2 D2.2 D3.1 Q1.3), U_Motors-Encoders/H-Bridge1 (8 pins), U_Motors-Encoders/H_Bridge_2 (8 pins)
CAN_RX: CANbus (U9.2), PIC32MK (U6.30)
CAN_TX: CANbus (U9.3), PIC32MK (U6.31)
EMA1: PIC32MK (U6.45), U_Motors-Encoders/Encoder_Motor_1 (R13_Encoder_Motor_1.1 R15_Encoder_Motor_1.2)
EMA2: PIC32MK (U6.12), U_Motors-Encoders/Encoder_Motor_2 (R13_Encoder_Motor_2.1 R15_Encoder_Motor_2.2)
EMB1: PIC32MK (U6.47), U_Motors-Encoders/Encoder_Motor_1 (R14_Encoder_Motor_1.1 R16_Encoder_Motor_1.2)
EMB2: PIC32MK (U6.11), U_Motors-Encoders/Encoder_Motor_2 (R14_Encoder_Motor_2.1 R16_Encoder_Motor_2.2)
EOA1: PIC32MK (U6.46), U_Motors-Encoders/Encoder_Odometry_1 (R13_Encoder_Odometry_1.1 R15_Encoder_Odometry_1.2)
EOA2: PIC32MK (U6.13), U_Motors-Encoders/Encoder_Odometry_2 (R13_Encoder_Odometry_2.1 R15_Encoder_Odometry_2.2)
EOB1: PIC32MK (U6.48), U_Motors-Encoders/Encoder_Odometry_1 (R14_Encoder_Odometry_1.1 R16_Encoder_Odometry_1.2)
EOB2: PIC32MK (U6.14), U_Motors-Encoders/Encoder_Odometry_2 (R14_Encoder_Odometry_2.1 R16_Encoder_Odometry_2.2)
INA1: PIC32MK (U6.2), U_Motors-Encoders/H-Bridge1 (R21_H-Bridge1.2)
INA2: PIC32MK (U6.62), U_Motors-Encoders/H_Bridge_2 (R21_H_Bridge_2.2)
INB1: PIC32MK (U6.3), U_Motors-Encoders/H-Bridge1 (R22_H-Bridge1.2)
INB2: PIC32MK (U6.63), U_Motors-Encoders/H_Bridge_2 (R22_H_Bridge_2.2)
INH1: PIC32MK (U6.1), U_Motors-Encoders/H-Bridge1 (R18_H-Bridge1.2 R19_H-Bridge1.2 R20_H-Bridge1.2)
INH2: PIC32MK (U6.64), U_Motors-Encoders/H_Bridge_2 (R18_H_Bridge_2.2 R19_H_Bridge_2.2 R20_H_Bridge_2.2)
ISA1: PIC32MK (U6.17), U_Motors-Encoders/H-Bridge1 (C15_H-Bridge1.2 R23_H-Bridge1.2 U4_H-Bridge1.6)
ISA2: PIC32MK (U6.21), U_Motors-Encoders/H_Bridge_2 (C15_H_Bridge_2.2 R23_H_Bridge_2.2 U4_H_Bridge_2.6)
ISB1: PIC32MK (U6.18), U_Motors-Encoders/H-Bridge1 (C16_H-Bridge1.2 R24_H-Bridge1.2 U5_H-Bridge1.6)
ISB2: PIC32MK (U6.22), U_Motors-Encoders/H_Bridge_2 (C16_H_Bridge_2.2 R24_H_Bridge_2.2 U5_H_Bridge_2.6)
~{MCLR}: PIC32MK (P3.1 U6.7), MCLR_PIC (R27.2)
OSC1: PIC32MK (U6.39), 8MHz_Crystal (C17.2 Y1.1)
OSC2: PIC32MK (U6.40), 8MHz_Crystal (C18.2 Y1.3)
UART_RX: Communication (J1.2), PIC32MK (U6.51)
UART_TX: Communication (J1.3), PIC32MK (U6.50)